# EAGLE design ACCUM-POWER (EAGLE 9.4.0)
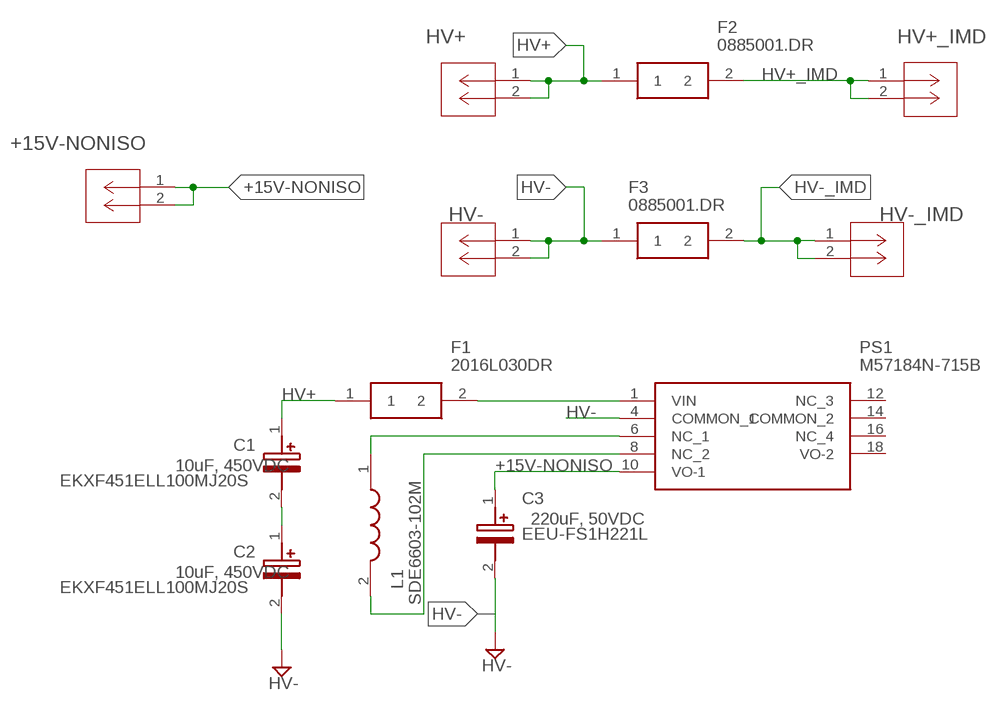
[diagram p0: schematic, sheet 1]

## Parts
+15V-NONISO  2P(90DEG)_1-770966-0  [CON2_1X2_P163_RAMNL]
C1  EKXF451ELL100MJ20S  [CAPPRD500W60D1025H2150]
C2  EKXF451ELL100MJ20S  [CAPPRD500W60D1025H2150]
C3  EEU-FS1H221L  [CAPPRD350W65D800H2200]
F1  2016L030DR  [FUSC5141X125N]
F2  0885001.DR  [FUSC10948X488N]
F3  0885001.DR  [FUSC10948X488N]
HV+  2P(90DEG)_1-770966-0  [CON2_1X2_P163_RAMNL]
HV+_IMD  2P(90DEG)_1-770966-0  [CON2_1X2_P163_RAMNL]
HV-  2P(90DEG)_1-770966-0  [CON2_1X2_P163_RAMNL]
HV-_IMD  2P(90DEG)_1-770966-0  [CON2_1X2_P163_RAMNL]
L1  SDE6603-102M  [SDE6603]
PS1  M57184N-715B  [M57184N715B]

## Nets
+15V-NONISO: +15V-NONISO.1 +15V-NONISO.2 C3.1(+) PS1.10(VO-1)
HV+: C1.1(+) F1.1 F2.1 HV+.1 HV+.2
HV+_IMD: F2.2 HV+_IMD.1 HV+_IMD.2
HV-: C2.2(-) C3.2(-) F3.1 HV-.1 HV-.2 PS1.4(COMMON_1)
HV-_IMD: F3.2 HV-_IMD.1 HV-_IMD.2
N$1: L1.2 PS1.8(NC_2)
N$2: L1.1 PS1.6(NC_1)
N$3: C1.2(-) C2.1(+)
N$4: F1.2 PS1.1(VIN)
Unconnected: PS1.12(NC_3) PS1.14(COMMON_2) PS1.16(NC_4) PS1.18(VO-2)

## Notes on the sheet
- 10uF, 450VDC
- 220uF, 50VDC
- 10uF, 450VDC

## Library data of the parts
+15V-NONISO HV+ HV+_IMD HV- HV-_IMD = con-MATE-N-LOK:2P(90DEG)_1-770966-0; MANUFACTURER_PART_NUMBER: 17709660; VENDOR: TE Connectivity
C1 C2 = EKXF451ELL100MJ20S:EKXF451ELL100MJ20S: Aluminum Electrolytic Capacitors - Radial Leaded 10uF 20% 450V Long Life Source: Datasheet <https://www.mouser.com/datasheet/2/420/United-Chemi-Con-1511290.pdf>; DESCRIPTION: Aluminum Electrolytic Capacitors - Radial Leaded 10uF 20% 450V Long Life; HEIGHT: 21.5mm; MANUFACTURER_NAME: United Chemi-Con (UCC); MANUFACTURER_PART_NUMBER: EKXF451ELL100MJ20S; MOUSER_PART_NUMBER: 661-EKXF451ELL100MJ2
C3 = EEU-FS1H221L:EEU-FS1H221L: Aluminum Electrolytic Capacitors - Radial Leaded 50VDC 220uF 9000H 8x20mm Source: Datasheet <https://componentsearchengine.com/Datasheets/1/EEU-FS1H221L.pdf>; DESCRIPTION: Aluminum Electrolytic Capacitors - Radial Leaded 50VDC 220uF 9000H 8x20mm; HEIGHT: 22mm; MANUFACTURER_NAME: Panasonic; MANUFACTURER_PART_NUMBER: EEU-FS1H221L; MOUSER_PART_NUMBER: 667-EEU-FS1H221L; MOUSER_PRICE-STOCK: https://www.mouser.com/Search/Refine.aspx?Keyword=667-EEU-FS1H221L
F1 = SamacSys_Parts:2016L030DR: Littelfuse 0.3A Surface Mount Resettable Fuse, 60 V dc Source: Datasheet <https://componentsearchengine.com/Datasheets/1/2016L030DR.pdf>; DESCRIPTION: Littelfuse 0.3A Surface Mount Resettable Fuse, 60 V dc; HEIGHT: 1.25mm; MANUFACTURER_NAME: LITTELFUSE; MANUFACTURER_PART_NUMBER: 2016L030DR; MOUSER_PART_NUMBER: 576-2016L030DR; MOUSER_PRICE-STOCK: https://www.mouser.com/Search/Refine.aspx?Keyword=576-2016L030DR
F2 F3 = 0885001.DR:0885001.DR: LITTELFUSE - 0885001.DR - FUSE, AEC-Q200, 1A, 500VDC, 0402 Source: Datasheet <https://m.littelfuse.com/~/media/electronics/datasheets/fuses/littelfuse_fuse_885_datasheet.pdf.pdf>; DESCRIPTION: LITTELFUSE - 0885001.DR - FUSE, AEC-Q200, 1A, 500VDC, 0402; HEIGHT: 4.88mm; MANUFACTURER_NAME: LITTELFUSE; MANUFACTURER_PART_NUMBER: 0885001.DR; MOUSER_PART_NUMBER: 576-0885001.DR; MOUSER_PRICE-STOCK: https://www.mouser.com/Search/Refine.aspx?Keyword=576-0885001.DR
L1 = SDE6603-102M:SDE6603-102M: SMD Power Inductor 1000uH 20% 250mA 6603 Bourns SDE6603 Series Shielded Wire-wound SMD Inductor with a Ferrite Core, 1000 uH Wire-Wound 70mA Idc Source: Datasheet <https://componentsearchengine.com/Datasheets/1/SDE6603-102M.pdf>; DESCRIPTION: SMD Power Inductor 1000uH 20% 250mA 6603 Bourns SDE6603 Series Shielded Wire-wound SMD Inductor with a Ferrite Core, 1000 uH Wire-Wound 70mA Idc; HEIGHT: mm; MANUFACTURER_NAME: Bourns; MANUFACTURER_PART_NUMBER: SDE6603-102M; MOUSER_PART_NUMBER: 652-SDE6603-102M; MOUSER_PRICE-STOCK: https://www.mouser.com/Search/Refine.aspx?Keyword=652-SDE6603-102M
PS1 = M57184N-715B:M57184N-715B: High Voltage Input DC-to-DC Converter Source: Datasheet <https://4donline.ihs.com/images/VipMasterIC/IC/PWRX/PWRXS01028/PWRXS01028-1.pdf?hkey=EF798316E3902B6ED9A73243A3159BB0>; DESCRIPTION: High Voltage Input DC-to-DC Converter; HEIGHT: 24.5mm; MANUFACTURER_NAME: POWEREX; MANUFACTURER_PART_NUMBER: M57184N-715B

## Board
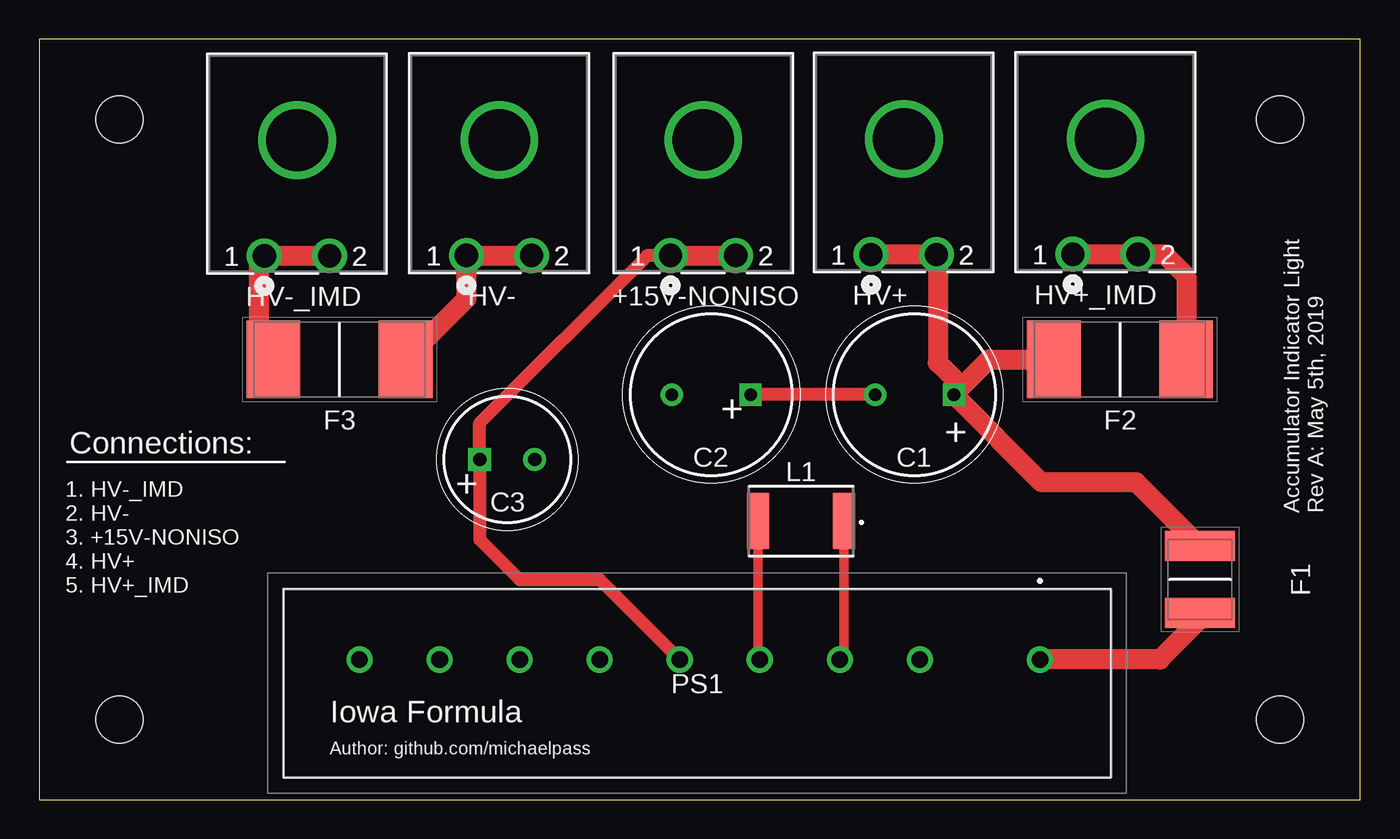
[diagram p1: board, top side]
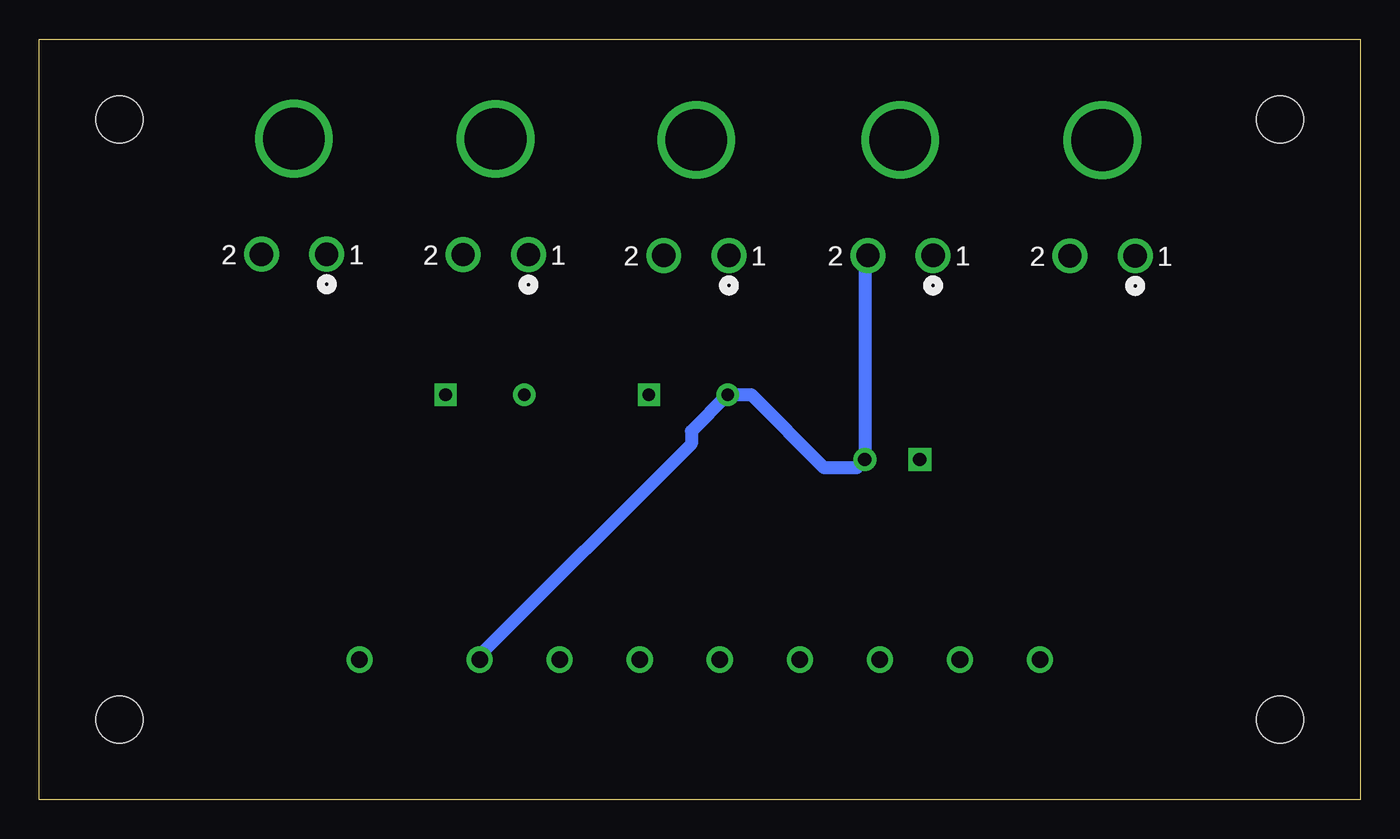
[diagram p2: board, bottom side, seen from below]

Size 83.82 x 48.26 mm. Coordinates in mm from the lower left corner, seen from the top.
Outline: 0,0 83.82,0 83.82,48.26 0,48.26 0,0
Copper layers (1*16): Top 0.035mm / dielectric 1.5mm / Bottom 0.035mm
Design rules "default *": minimum track width 8mil, minimum drill 20mil, track to track 8mil, track to pad 8mil, pad to pad 8mil, via to via 8mil, smd to smd 8mil, copper to edge 10mil, drill to drill 8mil, minimum pad ring 12mil, minimum via ring 10mil, stop-mask expansion 4mil, vias tented up to drill 25mil, thermal gap 10mil
Holes 3 mm at 5.08,5.08 78.74,5.08 78.74,43.18 5.08,43.18

### Footprints (pad centres in the part's own frame; a part is rotated, then mirrored left to right if it is on the bottom)
CON2_1X2_P163_RAMNL = drill 1.473 pad 1.981: 1 -4.14,0; 2 0,0 | drill 3.912 pad 3.912: 3 -2.057,7.341
CAPPRD500W60D1025H2150 = drill 0.8 pad 1.2 square: 1 0,0 | drill 0.8 pad 1.2: 2 5,0
CAPPRD350W65D800H2200 = drill 0.85 pad 1.275 square: 1 0,0 | drill 0.85 pad 1.275: 2 3.5,0
FUSC5141X125N = smd 1.9 x 4.44: 1 -2.125,0; 2 2.125,0
FUSC10948X488N = smd 3.41 x 4.91: 1 -4.195,0; 2 4.195,0
SDE6603 = smd 1.4 x 3.56: 1 -2.73,0; 2 2.73,0
M57184N715B = drill 1.05 pad 1.575: 1 0,0; 4 7.62,0; 6 12.7,0; 8 17.78,0; 10 22.86,0; 12 27.94,0; 14 33.02,0; 16 38.1,0; 18 43.18,0

### Placement (x,y rotation side)
+15V-NONISO  44.2,34.54 0 top
C1  58.04,25.7 180 top
C2  45.14,25.7 180 top
C3  27.94,21.59 0 top
F1  73.66,13.97 270 top
F2  68.58,27.94 0 top
F3  19.05,27.94 180 top
HV+  56.92,34.59 0 top
HV+_IMD  69.72,34.62 0 top
HV-  31.24,34.54 0 top
HV-_IMD  18.41,34.52 0 top
L1  48.34,17.68 180 top
PS1  63.5,8.89 180 top

### Tracks (layer width: path | path; a pad name or v marks a point on that pad's centre or on a via)
+15V-NONISO
  Top 0.813: PS1.10 35.56,13.97 30.48,13.97 27.94,16.51 C3.1 27.94,23.9 38.58,34.54 +15V-NONISO.1
  Top 1.27: +15V-NONISO.1 +15V-NONISO.2
HV+
  Top 0.813: HV+.2 57.02,34.49
  Top 1.27: HV+.2 HV+.1 | 57.02,34.49 57.02,27.74 58.04,26.72 C1.1 | C1.1 63.6,20.14 69.61,20.14 F1.1 | C1.1 60.27,27.94 F2.1
HV+_IMD
  Top 1.27: HV+_IMD.1 HV+_IMD.2 71.4,34.62 72.78,33.24 F2.2
HV-
  Top 1.27: HV-.2 HV-.1 27.1,31.8 F3.1
  Bottom 0.813: HV-.2 31.44,34.35 C3.2 31.95,21.08 34.01,21.08 38.64,25.7 C2.2 42.45,23.39 42.45,22.58 55.88,9.15 PS1.4
HV-_IMD
  Top 1.27: HV-_IMD.2 HV-_IMD.1 13.91,34.16 13.91,28.88 F3.2
N$1
  Top 0.61: PS1.8 45.61,9 L1.2
N$2
  Top 0.61: PS1.6 51.07,9.16 L1.1
N$3
  Top 0.813: C1.2 C2.1
N$4
  Top 0.813: F1.2 73.66,11.43
  Top 1.27: 73.66,11.43 71.12,8.89 PS1.1

### Text on the board
tNames: + | Connections: | + | + | Accumulator Indicator Light / Rev A: May 5th, 2019 | 1. HV-_IMD / 2. HV- / 3. +15V-NONISO / 4. HV+ / 5. HV+_IMD | Iowa Formula | Author: github.com/michaelpass